# Altium schematic sheet PWR_MGMT.SchDoc
size C; SheetNumber: 2; SheetTotal: 8
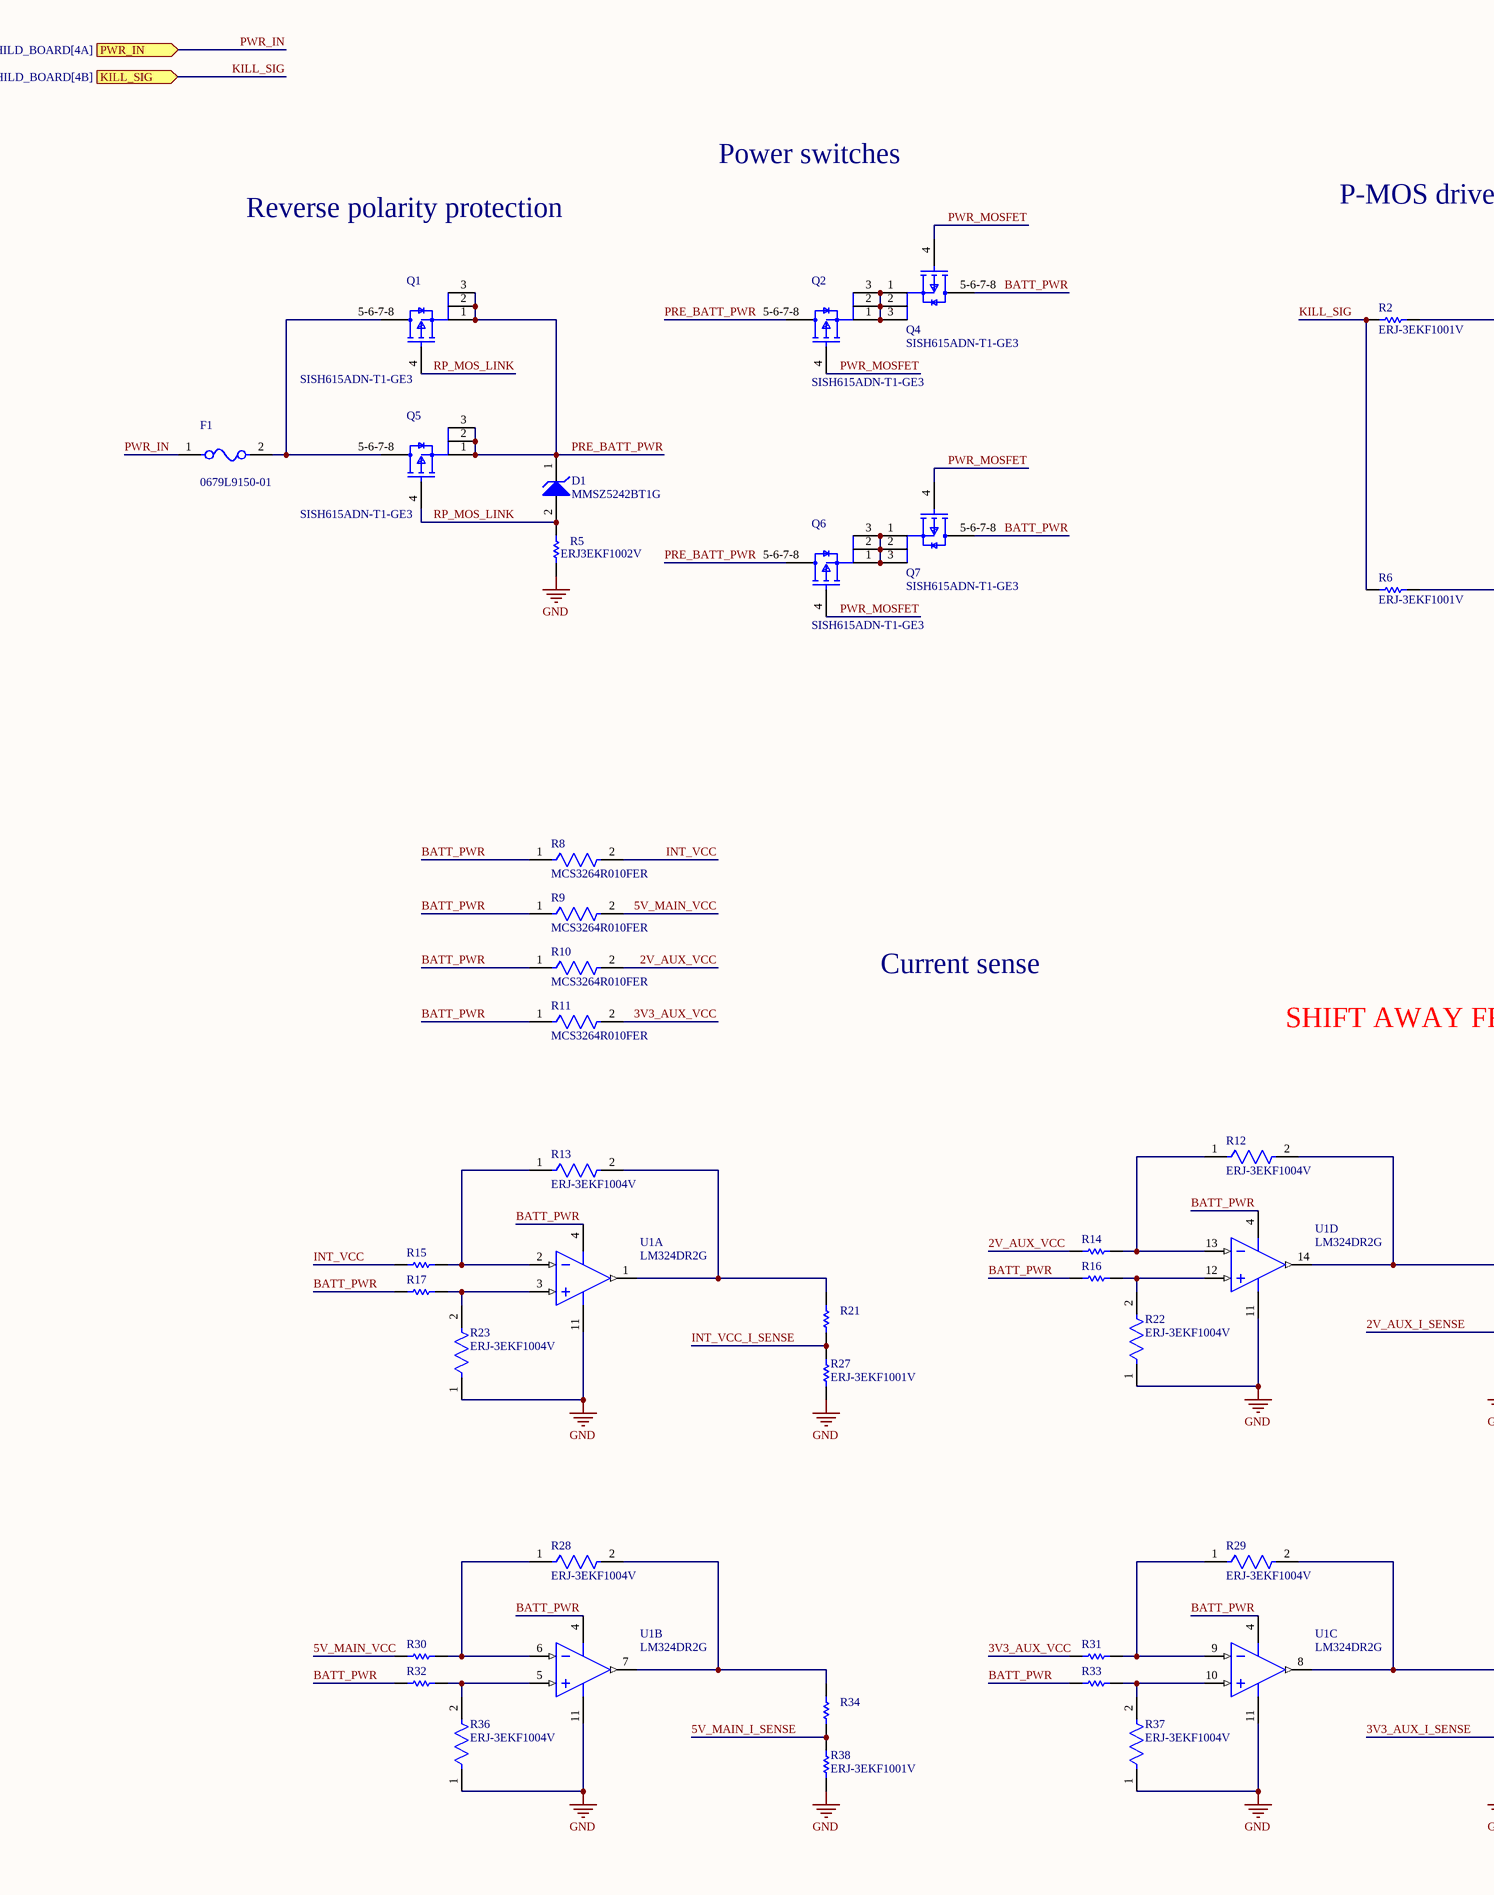
[diagram p0: PWR_MGMT.SchDoc, left]
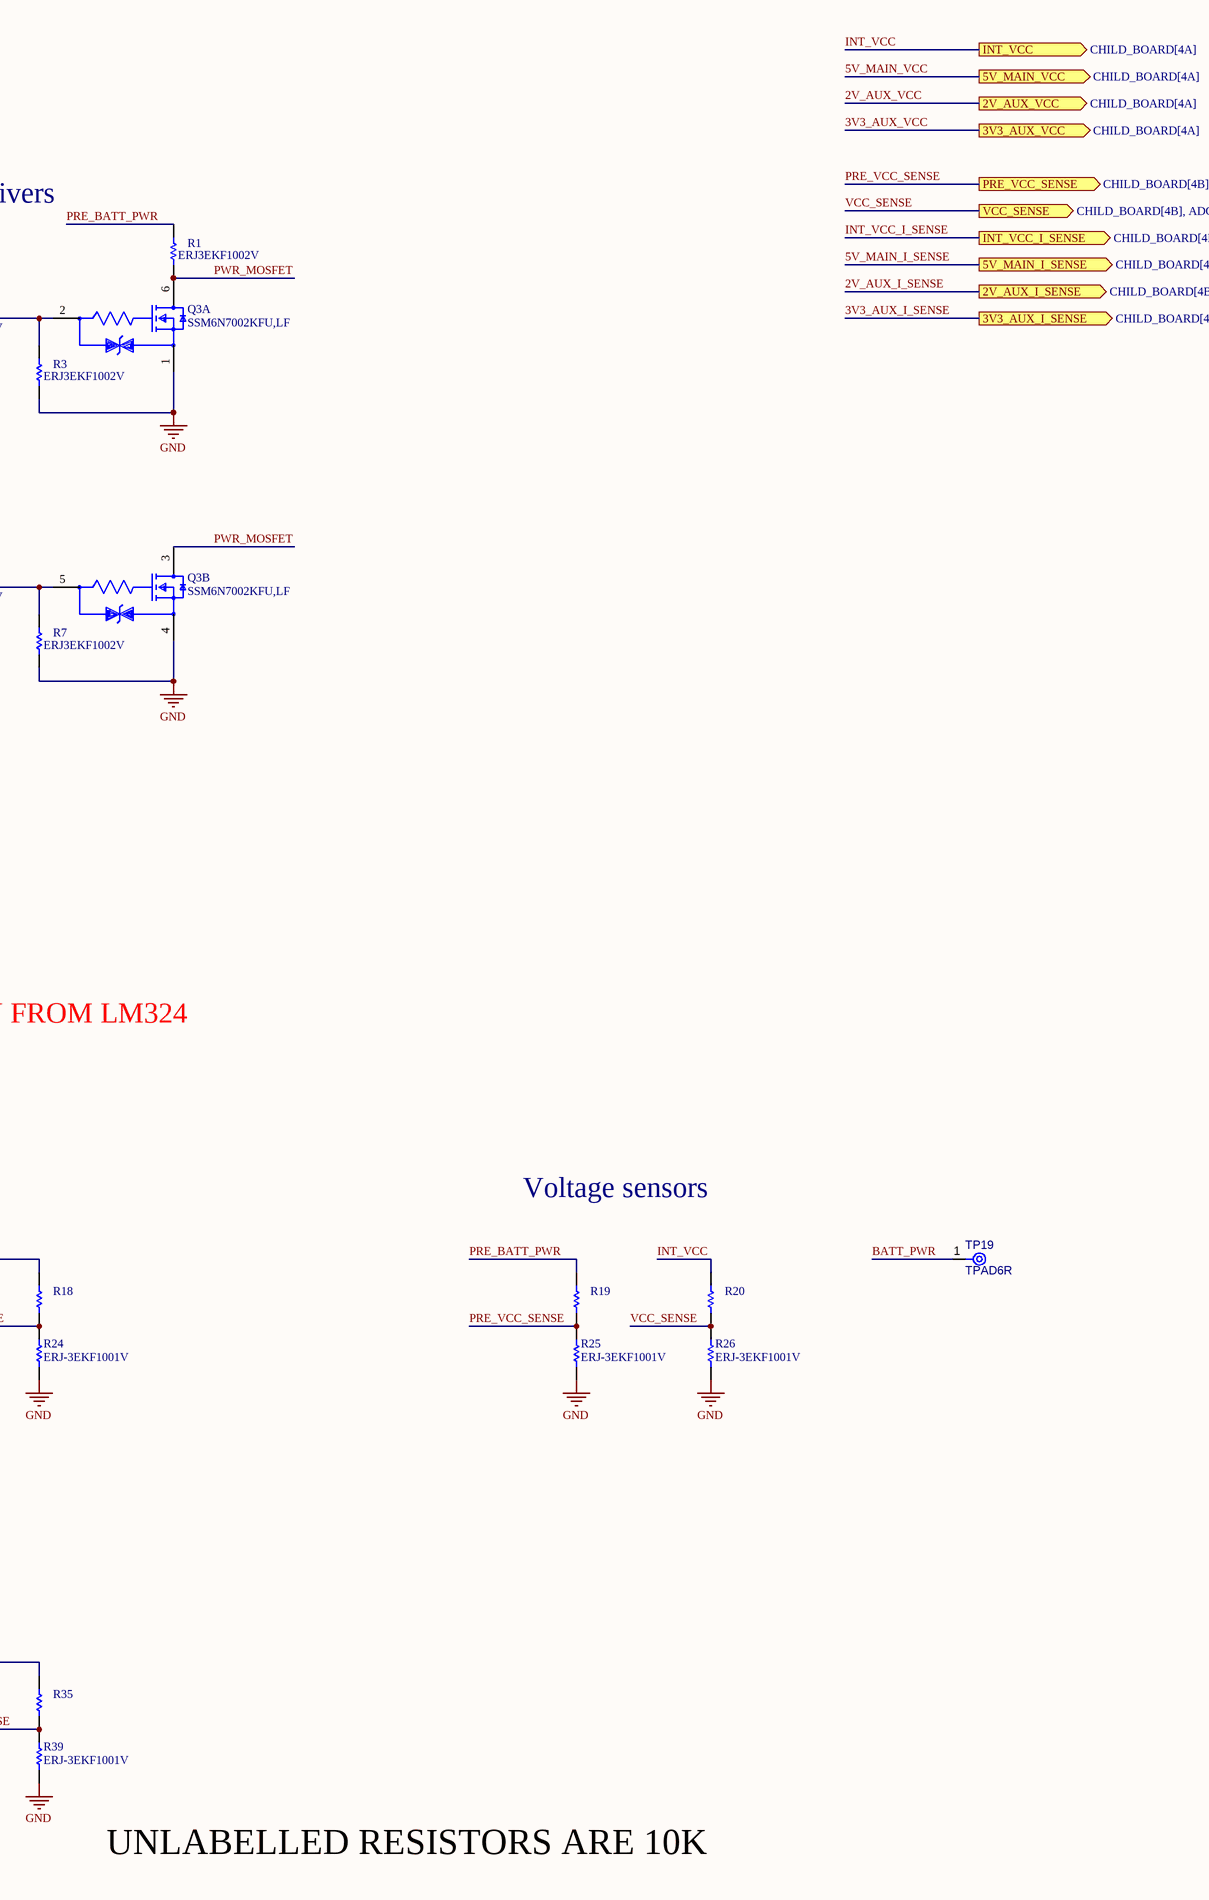
[diagram p1: PWR_MGMT.SchDoc, right]

## Parts
D1  MMSZ5242BT1G  [ONSC-SOD-123-2-425-04_V]
F1  0679L9150-01  [FP-0679L-MFG]
Q1  SISH615ADN-T1-GE3  [SISH615ADN-T1-GE3-Footprint-1]
Q2  SISH615ADN-T1-GE3  [SISH615ADN-T1-GE3-Footprint-1]
Q3  SSM6N7002KFU,LF  [FP-SSOP6-P-0_65A-MFG]  (parts A,B of 2)
Q4  SISH615ADN-T1-GE3  [SISH615ADN-T1-GE3-Footprint-1]
Q5  SISH615ADN-T1-GE3  [SISH615ADN-T1-GE3-Footprint-1]
Q6  SISH615ADN-T1-GE3  [SISH615ADN-T1-GE3-Footprint-1]
Q7  SISH615ADN-T1-GE3  [SISH615ADN-T1-GE3-Footprint-1]
R1  ERJ3EKF1002V  [RESC1609X55X30LL15T15]
R2  ERJ-3EKF1001V  [RESC1608X55X30LL15T15]
R3  ERJ3EKF1002V  [RESC1609X55X30LL15T15]
R5  ERJ3EKF1002V  [RESC1609X55X30LL15T15]
R6  ERJ-3EKF1001V  [RESC1608X55X30LL15T15]
R7  ERJ3EKF1002V  [RESC1609X55X30LL15T15]
R8  MCS3264R010FER  [FP-MCS3264-MFG]
R9  MCS3264R010FER  [FP-MCS3264-MFG]
R10  MCS3264R010FER  [FP-MCS3264-MFG]
R11  MCS3264R010FER  [FP-MCS3264-MFG]
R12  ERJ-3EKF1004V  [FP-ERJ3EK-IPC_C]
R13  ERJ-3EKF1004V  [FP-ERJ3EK-IPC_C]
R14  ERJ3EKF1002V  [RESC1609X55X30LL15T15]  (value not drawn)
R15  ERJ3EKF1002V  [RESC1609X55X30LL15T15]  (value not drawn)
R16  ERJ3EKF1002V  [RESC1609X55X30LL15T15]  (value not drawn)
R17  ERJ3EKF1002V  [RESC1609X55X30LL15T15]  (value not drawn)
R18  ERJ3EKF1002V  [RESC1609X55X30LL15T15]  (value not drawn)
R19  ERJ3EKF1002V  [RESC1609X55X30LL15T15]  (value not drawn)
R20  ERJ3EKF1002V  [RESC1609X55X30LL15T15]  (value not drawn)
R21  ERJ3EKF1002V  [RESC1609X55X30LL15T15]  (value not drawn)
R22  ERJ-3EKF1004V  [FP-ERJ3EK-IPC_C]
R23  ERJ-3EKF1004V  [FP-ERJ3EK-IPC_C]
R24  ERJ-3EKF1001V  [RESC1608X55X30LL15T15]
R25  ERJ-3EKF1001V  [RESC1608X55X30LL15T15]
R26  ERJ-3EKF1001V  [RESC1608X55X30LL15T15]
R27  ERJ-3EKF1001V  [RESC1608X55X30LL15T15]
R28  ERJ-3EKF1004V  [FP-ERJ3EK-IPC_C]
R29  ERJ-3EKF1004V  [FP-ERJ3EK-IPC_C]
R30  ERJ3EKF1002V  [RESC1609X55X30LL15T15]  (value not drawn)
R31  ERJ3EKF1002V  [RESC1609X55X30LL15T15]  (value not drawn)
R32  ERJ3EKF1002V  [RESC1609X55X30LL15T15]  (value not drawn)
R33  ERJ3EKF1002V  [RESC1609X55X30LL15T15]  (value not drawn)
R34  ERJ3EKF1002V  [RESC1609X55X30LL15T15]  (value not drawn)
R35  ERJ3EKF1002V  [RESC1609X55X30LL15T15]  (value not drawn)
R36  ERJ-3EKF1004V  [FP-ERJ3EK-IPC_C]
R37  ERJ-3EKF1004V  [FP-ERJ3EK-IPC_C]
R38  ERJ-3EKF1001V  [RESC1608X55X30LL15T15]
R39  ERJ-3EKF1001V  [RESC1608X55X30LL15T15]
TP19  TPAD6R  [TP06R]  (no BOM)
U1  LM324DR2G  [ONSC-SOIC-14-751A-03_V]  (parts A,B,C,D of 4)

## Ports
2V_AUX_I_SENSE (out, see CHILD_BOARD[4B], ADC[1B]), 2V_AUX_VCC (out, see CHILD_BOARD[4A]), 3V3_AUX_I_SENSE (out, see CHILD_BOARD[4B], ADC[1B]), 3V3_AUX_VCC (out, see CHILD_BOARD[4A]), 5V_MAIN_I_SENSE (out, see CHILD_BOARD[4B], ADC[1B]), 5V_MAIN_VCC (out, see CHILD_BOARD[4A]), INT_VCC (out, see CHILD_BOARD[4A]), INT_VCC_I_SENSE (out, see CHILD_BOARD[4B], ADC[1B]), KILL_SIG (in, see CHILD_BOARD[4B]), PRE_VCC_SENSE (out, see CHILD_BOARD[4B], ADC[1A]), PWR_IN (in, see CHILD_BOARD[4A]), VCC_SENSE (out, see CHILD_BOARD[4B], ADC[1A])

## Nets
GND: Q3.1(Source1) Q3.4(Source2) R3.2 R5.2 R7.2 R22.1 R23.1 R24.1 R25.1 R26.1 R27.1 R36.1 R37.1 R38.1 R39.1 U1.11(VEE/GND)
2V_AUX_I_SENSE: R18.2 R24.2 ; port 2V_AUX_I_SENSE
2V_AUX_VCC: R10.2 R14.1 ; port 2V_AUX_VCC
3V3_AUX_I_SENSE: R35.2 R39.2 ; port 3V3_AUX_I_SENSE
3V3_AUX_VCC: R11.2 R31.1 ; port 3V3_AUX_VCC
5V_MAIN_I_SENSE: R34.2 R38.2 ; port 5V_MAIN_I_SENSE
5V_MAIN_VCC: R9.2 R30.1 ; port 5V_MAIN_VCC
BATT_PWR: Q4.5-6-7-8(D) Q7.5-6-7-8(D) R8.1 R9.1 R10.1 R11.1 R16.1 R17.1 R32.1 R33.1 TP19.1(TP) U1.4(VCC)
INT_VCC: R8.2 R15.1 R20.1 ; port INT_VCC
INT_VCC_I_SENSE: R21.2 R27.2 ; port INT_VCC_I_SENSE
KILL_SIG: R2.1 R6.1 ; port KILL_SIG
PRE_BATT_PWR: D1.1(K) Q1.1(S) Q1.2(S) Q1.3(S) Q2.5-6-7-8(D) Q5.1(S) Q5.2(S) Q5.3(S) Q6.5-6-7-8(D) R1.1 R19.1
PRE_VCC_SENSE: R19.2 R25.2 ; port PRE_VCC_SENSE
PWR_IN: F1.1 ; port PWR_IN
PWR_MOSFET: Q2.4(G) Q3.3(Drain2) Q3.6(Drain1) Q4.4(G) Q6.4(G) Q7.4(G) R1.2
RP_MOS_LINK: D1.2(A) Q1.4(G) Q5.4(G) R5.1
VCC_SENSE: R20.2 R26.2 ; port VCC_SENSE
NetF1_2: F1.2 Q1.5-6-7-8(D) Q5.5-6-7-8(D)
NetQ2_1: Q2.1(S) Q2.2(S) Q2.3(S) Q4.1(S) Q4.2(S) Q4.3(S)
NetQ3_2: Q3.2(Gate1) R2.2 R3.1
NetQ3_5: Q3.5(Gate2) R6.2 R7.1
NetQ6_1: Q6.1(S) Q6.2(S) Q6.3(S) Q7.1(S) Q7.2(S) Q7.3(S)
NetR12_1: R12.1 R14.2 U1.13(IN4-)
NetR12_2: R12.2 R18.1 U1.14(OUT4)
NetR13_1: R13.1 R15.2 U1.2(IN1-)
NetR13_2: R13.2 R21.1 U1.1(OUT1)
NetR16_2: R16.2 R22.2 U1.12(IN4+)
NetR17_2: R17.2 R23.2 U1.3(IN1+)
NetR28_1: R28.1 R30.2 U1.6(IN2-)
NetR28_2: R28.2 R34.1 U1.7(OUT2)
NetR29_1: R29.1 R31.2 U1.9(IN3-)
NetR29_2: R29.2 R35.1 U1.8(OUT3)
NetR32_2: R32.2 R36.2 U1.5(IN2+)
NetR33_2: R33.2 R37.2 U1.10(IN3+)

## Notes on the sheet
- Power switches
- P-MOS drivers
- Reverse polarity protection
- Current sense
- SHIFT AWAY FROM LM324
- Voltage sensors
- UNLABELLED RESISTORS ARE 10K

## Library data of the parts
D1 = CMP-1060-00565-1: Zener Voltage Regulator, 500 mW, 2-Pin SOD-123, Pb-Free, Tape and Reel; Manufacturer: On Semiconductor; P Max (W): 0.5; VZ Typ (V): 12; PartNumber: MMSZ5242BT1G; PackageReference: SOD-123-2-425-04; ComponentLink3URL: http://www.onsemi.com/pub_link/Collateral/425-04.PDF; Mounting Technology: Surface Mount; ComponentLink2Description: Datasheet; ComponentLink1URL: http://www.onsemi.com/; ComponentLink3Description: Package Specification; PackageDescription: 2-Pin SOD, Body 1.6 x 2.69 mm; PackageVersion: Rev. G, 10/2009; ComponentLink1Description: Manufacturer URL; RoHS: Pb-Free; ComponentLink2URL: http://www.onsemi.com/pub_link/Collateral/MMSZ5221BT1-D.PDF; Packing: Tape and Reel; DatasheetVersion: Rev. 12
F1 = CMP-16042-000002-1: FUSE BRD MNT 15A 125VAC/VDC; Manufacturer: Bel Fuse; Max Fuse Ac Voltage: 125V; Fuse Blow Speed: Fast; Fuse I2T: 103.5A2Sec; Fuse Interrupt Ac Current: 50A; Automotive Grade: Grade 1; Value: 0.0038Ω; Fuse Interrupt Dc Current: 300A; Fuse Voltage Drop: 0.13V; Device Class L2: Fuses; ComponentLink2URL: https://www.belfuse.com/resources/CircuitProtection/datasheets/0679L%20Sep2016.pdf; Package: 0679L; Height: 2.79mm; Digikey Description: FUSE BRD MNT 15A 125VAC/VDC; Temperature Range High: +125°C; Device Class L3: unset; Octopart: https://octopart.com/0679l9150-01-bel+fuse-70850665; Temperature Range Low: -55°C; Fuse Current: 15A; Max Fuse Dc Voltage: 125V; Ipc Land Pattern Name: CAPC610254X254; Manufacturer Part Number: 0679L9150-01; Category: Fuse; Lead Free: Yes; Automotive: Yes; Resistance: 0.0038Ω; RoHS: TRUE; Device Class L1: Circuit Protection; ComponentLink2Description: Datasheet; Temperature: -55°C to +125°C; Voltage Rating: 125V
Q1 Q2 Q4-Q7 = CMP-013-00036-2: Trans MOSFET P-CH 20V 22.1A 8-Pin PowerPAK 1212 EP T/R
Q3 = CMP-35916-000009-1: MOSFET 2N-CH 60V 0.3A; Input Capacitance: 40pF; Continuous Drain Current (ID): 300mA; Max Power Dissipation: 285mW; FET Type: 2 N-Channel; Rds On Max: 1.5R; Mount: Surface Mount; Drain to Source Voltage (Vdss): 60V; Packaging: Tape and Reel
R1 R3 R5 R7 R14-R21 R30-R35 = CMP-1012-00623-3: Chip Resistor, 10 KOhm, +/- 1%, 0.1 W, -55 to 155 degC, 0603 (1608 Metric), RoHS, Tape and Reel; Manufacturer: Panasonic; Voltage Rating: 75V; Case\/Package: 0603; Power Rating: 100mW; Resistance: 10KOhm; Temperature Coefficient: 100ppm\/degreesC; Number of Pins: 2; Package Reference: 603; Depth: 0.8mm; Mount: SurfaceMount; Package Description: 2-Pin Surface Mount Device, Body 1.6 x 0.85 mm; Datasheet Version: 02/2017; Length: 1.6mm; Lead Free: LeadFree; Height: 0.45mm; Number of Terminations: 2; Max Power Dissipation: 100mW; Min Operating Temperature: -55degC; Datasheet URL: https://industrial.panasonic.com/cdbs/www-data/pdf/RDA0000/AOA0000C304.pdf; Termination: SMD/SMT; Case Code (Metric): 1608; Case Code (Imperial): 0603; Tolerance: 1%; Max Operating Temperature: 155degC; RoHSCompliant: true; Voltage Rating (DC): 75V; Radiation Hardening: No; Packaging: TapeandReel; Composition: ThickFilm; Mounting Technology: SurfaceMount; Manufacturer URL: http://www.panasonic.com/; Width: 0.031inch; REACH SVHC: NoSVHC; Contact Plating: Tin; Military Standard: Not; Package Quantity: 1
R2 R6 R24-R27 R38 R39 = CMP-2000-00180-1: Manufacturer: Panasonic; Part Number: ERJ-3EKF1001V
R8-R11 = CMP-33361-000012-1: RES SMD 10 MOHM 1% 2W 3264; Temperature Coefficient: 50ppm/°C; Resistance: 10mR; Voltage Rating: 220mV; Case/Package: 2512; Military Standard: Not; Max Operating Temperature: 150°C; Height: 0.024inch; Package Quantity: 1; Case Code (Imperial): 2512; Number of Terminations: 2; Features: Flame Retardant Coating; Width: 0.126inch; Tolerance: 1%; Composition: Metal Element; Number of Pins: 2; Packaging: Tape and Reel; Depth: 3.2mm; Termination: SMD/SMT; Min Operating Temperature: -55°C; Power Rating: 2W; Case Code (Metric): 6432; Max Power Dissipation: 2W; Mount: Surface Mount; Length: 6.4mm
R12 R13 R22 R23 R28 R29 R36 R37 = CMP-1012-00849-3: RES SMD 1M OHM 1% 1/10W 0603; Resistance: 1MR; Voltage Rating: 75V; Temperature Coefficient: 100ppm/°C; Power Rating: 100mW; REACH SVHC: No SVHC; Radiation Hardening: No; Features: Automotive AEC-Q200; Case Code (Metric): 1608; Resistance Tolerance: 1%; Case/Package: 0603; Termination: SMD/SMT; Max Operating Temperature: 155°C; Tolerance: 1%; Size Code: 0603; Case Code (Imperial): 0603; Min Operating Temperature: -55°C; Number of Pins: 2; Mount: Surface Mount; Package Quantity: 1; Military Standard: Not; Voltage Rating (DC): 75V; Depth: 0.8mm; Packaging: Tape and Reel; Width: 0.8mm; Number of Terminations: 2; Length: 1.6mm; Height: 0.022inch; RoHS Compliant: Yes; Resistor Type: Thick Film; Contact Plating: Tin; Lead Free: Lead Free; Series: ERJ; Construction: Rectangular; Max Power Dissipation: 100mW
TP19 = CMP-00028-00002-2: 0.6mm round; Pins: 1
U1 = CMP-1310-00171-1: Single Supply Quad Operational Amplifier, 3 to 32 V, 0 to 70 degC, 14-Pin SOIC, Pb-Free, Tape and Reel; Manufacturer: On Semiconductor; VCC Max (V): 32; VCC Min (V): 3; PackageVersion: Rev. K, 05/2011; ComponentLink3URL: http://www.onsemi.com/pub_link/Collateral/751A-03.PDF; ComponentLink3Description: Package Specification; Packing: Tape and Reel; ComponentLink2URL: http://www.onsemi.cn/pub_link/Collateral/LM324-D.PDF; PackageReference: SOIC-14-751A-03; ComponentLink1URL: http://www.onsemi.com/; PackageDescription: 14-Pin Small Outline Integrated Circuit, Body 8.65 x 3.9 mm, Pitch 1.27 mm; ComponentLink1Description: Manufacturer URL; DatasheetVersion: Rev. 25; Mounting Technology: Surface Mount; RoHS: TRUE; ComponentLink2Description: Datasheet; PartNumber: LM324DR2G